# Altium schematic sheet schumann_exp.SchDoc
size A3; SheetNumber: 1; SheetTotal: 3
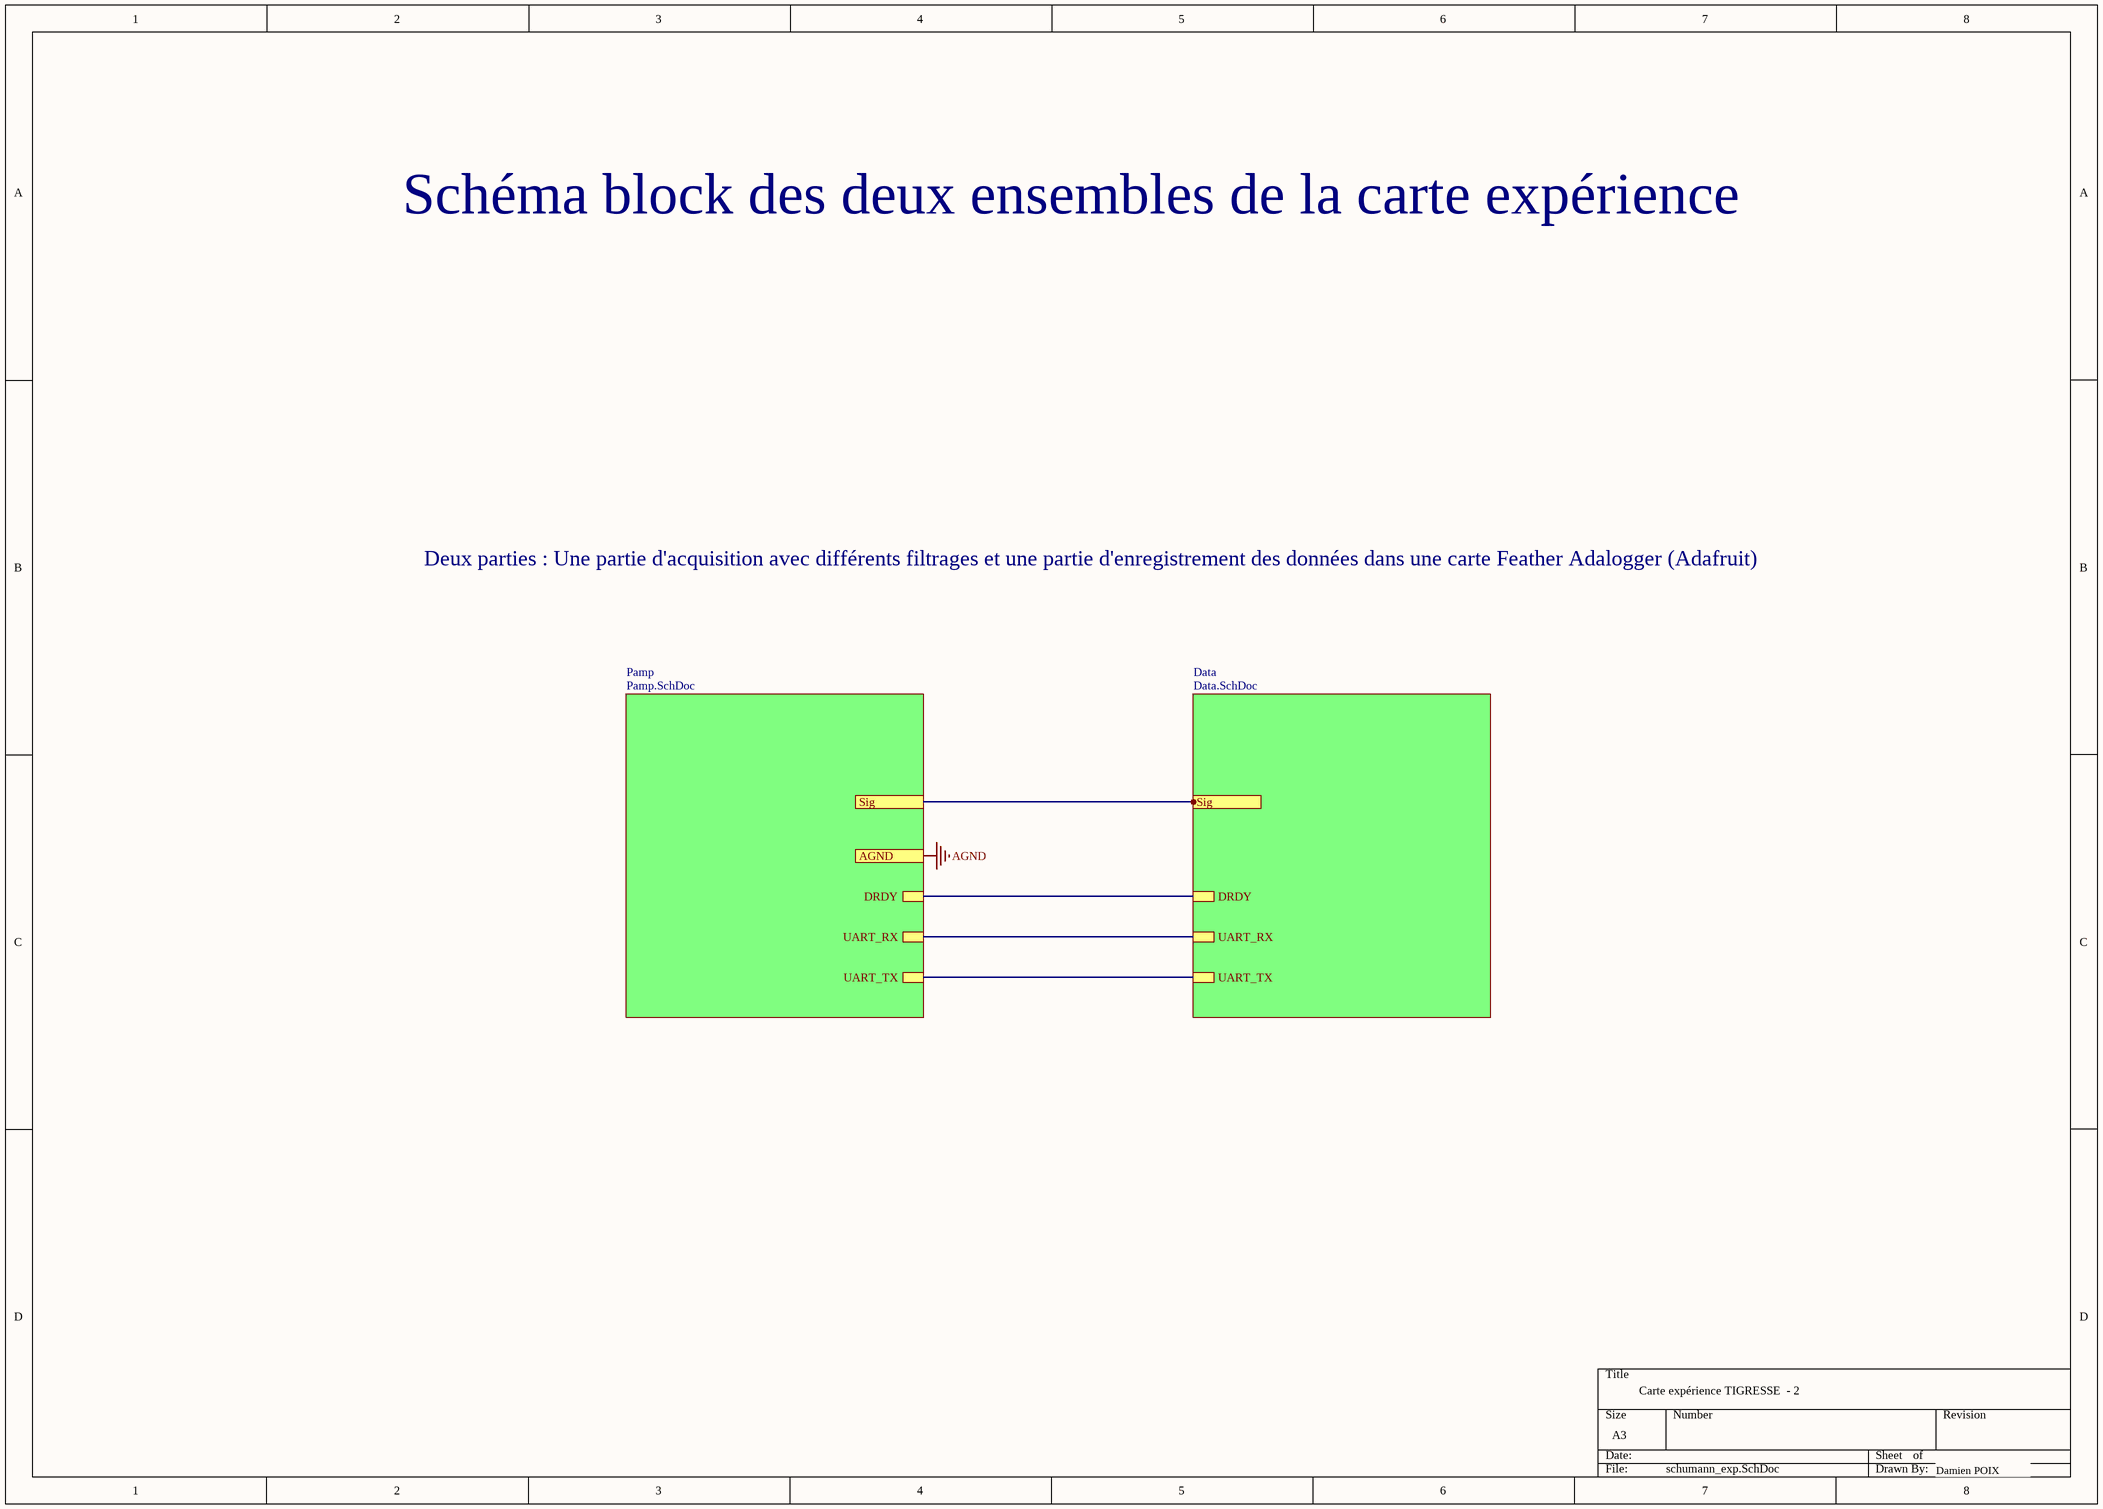
[diagram p0: schumann_exp.SchDoc]

## Sub-sheets
Data = Data.SchDoc: Sig, UART_TX, UART_RX, DRDY
Pamp = Pamp.SchDoc: UART_RX, UART_TX, DRDY

## Ports
AGND, Sig

## Nets
AGND: port AGND
Sig: port Sig, sheet Data/Sig
(unnamed): sheet Pamp/UART_RX, sheet Data/UART_RX
(unnamed): sheet Pamp/UART_TX, sheet Data/UART_TX
(unnamed): sheet Pamp/DRDY, sheet Data/DRDY

## Notes on the sheet
- Schéma block des deux ensembles de la carte expérience
- Deux parties : Une partie d'acquisition avec différents filtrages et une partie d'enregistrement des données dans une carte Feather Adalogger (Adafruit)
- Carte expérience TIGRESSE  - 2
- Damien POIX